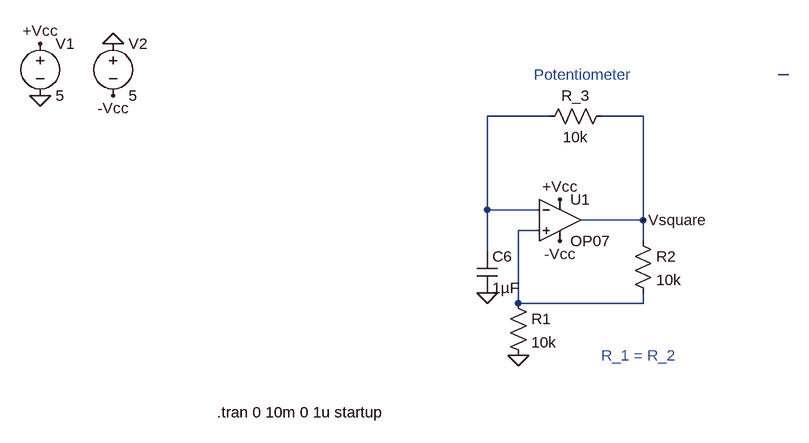
[diagram p0: schematic Square_wave_Op_Amp.asc]
Square_wave_Op_Amp.asc, the LTspice schematic file:
Version 4.1
SHEET 1 1520 1004
WIRE 816 -80 800 -80
WIRE 448 -16 352 -16
WIRE 592 -16 528 -16
WIRE 352 128 352 -16
WIRE 432 128 352 128
WIRE 592 144 592 -16
WIRE 592 144 496 144
WIRE 432 160 400 160
WIRE 592 176 592 144
WIRE 352 192 352 128
WIRE 400 272 400 160
WIRE 592 272 592 256
WIRE 592 272 400 272
FLAG 464 112 +Vcc
FLAG 464 176 -Vcc
FLAG -336 -48 0
FLAG -224 -128 0
FLAG -336 -128 +Vcc
FLAG -224 -48 -Vcc
FLAG 592 144 Vsquare
FLAG 352 256 0
FLAG 400 352 0
SYMBOL voltage -336 -144 R0
SYMATTR InstName V1
SYMATTR Value 5
SYMBOL voltage -224 -144 R0
WINDOW 123 0 0 Left 0
WINDOW 39 0 0 Left 0
SYMATTR InstName V2
SYMATTR Value 5
SYMBOL cap 336 192 R0
SYMATTR InstName C6
SYMATTR Value 1µF
SYMBOL OpAmps\\OP07 464 80 R0
SYMATTR InstName U1
SYMBOL res 384 256 R0
SYMATTR InstName R1
SYMATTR Value 10k
SYMBOL res 576 160 R0
SYMATTR InstName R2
SYMATTR Value 10k
SYMBOL res 544 -32 R90
WINDOW 0 0 56 VBottom 2
WINDOW 3 32 56 VTop 2
SYMATTR InstName R_3
SYMATTR Value 10k
TEXT -64 440 Left 2 !.tran 0 10m 0 1u startup
TEXT 528 352 Left 2 ;R_1 = R_2
TEXT 424 -80 Left 2 ;Potentiometer

The netlist it stands for:
* Square_wave_Op_Amp.asc
V1 +Vcc 0 5
V2 0 -Vcc 5
C6 N002 0 1µF
X§U1 N003 N002 +Vcc -Vcc Vsquare LT1001  ; OP07, pins In+ In- V+ V- OUT
R1 N003 0 10k
R2 Vsquare N003 10k
R_3 Vsquare N002 10k
.tran 0 10m 0 1u startup
* R_1 = R_2
* Potentiometer
.lib LTC.lib
.backanno
.end